# EAGLE design mp3 (EAGLE 9.1.1)
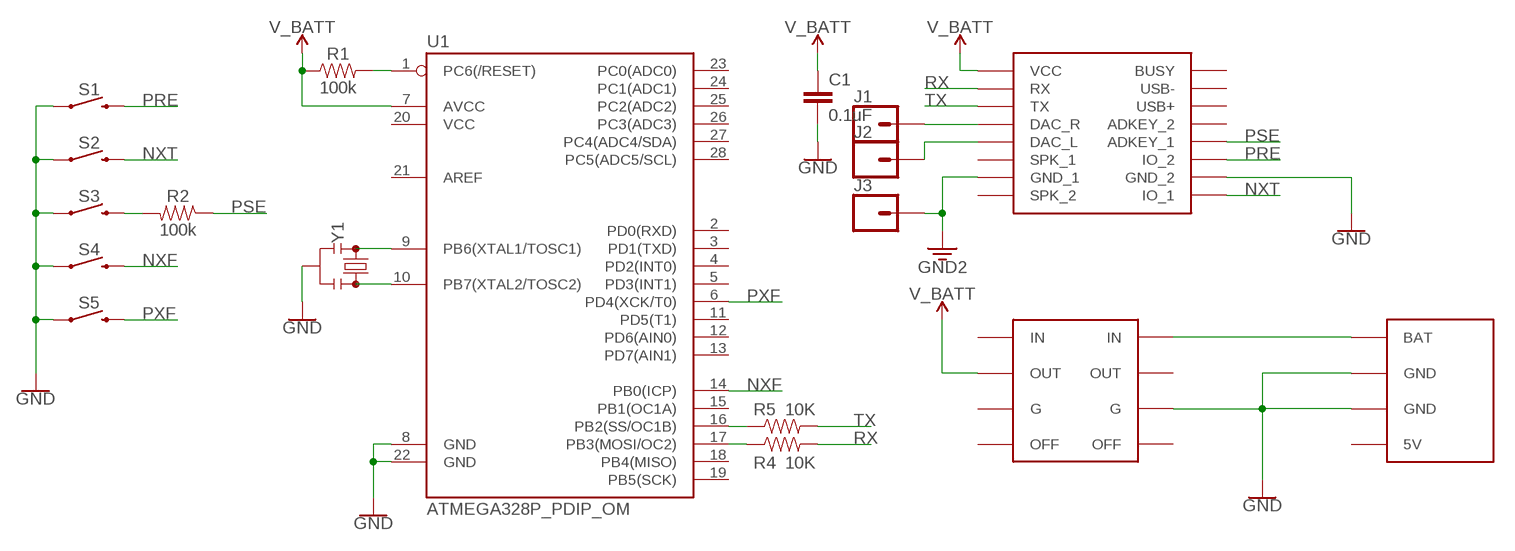
[diagram p0: schematic, sheet 1]

## Parts
C1  0.1uF  0.1UF-KIT-EZ-50V-20%  [CAP-PTH-SMALL-KIT]
J1  CONN_01PTH_NO_SILK_KIT  [1X01NS_KIT]
J2  CONN_01PTH_NO_SILK_KIT  [1X01NS_KIT]
J3  CONN_01PTH_NO_SILK_KIT  [1X01NS_KIT]
R1  100k  100KOHM-HORIZ-1/4W-1%  [AXIAL-0.3]
R2  100k  100KOHM-HORIZ-1/4W-1%  [AXIAL-0.3]
R4  10K  100KOHM-HORIZ-1/4W-1%  [AXIAL-0.3]
R5  10K  100KOHM-HORIZ-1/4W-1%  [AXIAL-0.3]
S1  MOMENTARY-SWITCH-SPST-PTH-RIGHT-ANGLE  [TACTILE_SWITCH_PTH_RIGHT_ANGLE]
S2  MOMENTARY-SWITCH-SPST-PTH-RIGHT-ANGLE  [TACTILE_SWITCH_PTH_RIGHT_ANGLE]
S3  MOMENTARY-SWITCH-SPST-PTH-RIGHT-ANGLE  [TACTILE_SWITCH_PTH_RIGHT_ANGLE]
S4  MOMENTARY-SWITCH-SPST-PTH-RIGHT-ANGLE  [TACTILE_SWITCH_PTH_RIGHT_ANGLE]
S5  MOMENTARY-SWITCH-SPST-PTH-RIGHT-ANGLE  [TACTILE_SWITCH_PTH_RIGHT_ANGLE]
U1  ATMEGA328P_PDIP_OM  [DIP28_OMILL]
U$1  DFPLAYER  [DFPLAYER]
U$2  ADAFRUIT_SOFTPOWER  [ADAFRUIT_SOFTPOWER]
U$3  ADAFRUIT_CHARGER  [ADAFRUIT_CHARGER]
Y1  RESONATOROM  [RESONATOR-PTH-7.6X3.3-OM]

## Nets
3.3V: J3.1 U$1.GND_1 ; supply symbol labelled GND2
GND: C1.2 S1.1 S2.1 S3.1 S4.1 S5.1 U1.8(GND) U1.22(GND) U$1.GND_2 U$2.P$2(G) U$3.P$2(GND) U$3.P$3(GND) Y1.2
N$1: U1.9(PB6(XTAL1/TOSC1)) Y1.1
N$2: U1.10(PB7(XTAL2/TOSC2)) Y1.3
N$3: R1.P$2 U1.1(PC6(/RESET))
N$4: R5.P$1 U1.17(PB3(MOSI/OC2))
N$5: R4.P$1 U1.16(PB2(SS/OC1B))
N$6: R2.P$2 S3.2
N$7: U$2.P$4(IN) U$3.P$1(BAT)
N$8: J1.1 U$1.DAC_R
N$9: J2.1 U$1.DAC_L
NXF: S4.2 U1.14(PB0(ICP))
NXT: S2.2 U$1.IO1(IO_1)
PRE: S1.2 U$1.IO2(IO_2)
PSE: R2.P$1 U$1.ADKEY1(ADKEY_1)
PXF: S5.2 U1.6(PD4(XCK/T0))
RX: R5.P$2 U$1.RX
TX: R4.P$2 U$1.TX
V_BATT: C1.1 R1.P$1 U1.7(AVCC) U$1.VCC U$2.P$6(OUT)
Unconnected: U1.2(PD0(RXD)) U1.3(PD1(TXD)) U1.4(PD2(INT0)) U1.5(PD3(INT1)) U1.11(PD5(T1)) U1.12(PD6(AIN0)) U1.13(PD7(AIN1)) U1.15(PB1(OC1A)) U1.18(PB4(MISO)) U1.19(PB5(SCK)) U1.20(VCC) U1.21(AREF) U1.23(PC0(ADC0)) U1.24(PC1(ADC1)) U1.25(PC2(ADC2)) U1.26(PC3(ADC3)) U1.27(PC4(ADC4/SDA)) U1.28(PC5(ADC5/SCL)) U$1.ADKEY2(ADKEY_2) U$1.BUSY U$1.SPK1(SPK_1) U$1.SPK2(SPK_2) U$1.USB+ U$1.USB- U$2.P$1(OFF) U$2.P$3(OUT) U$2.P$5(IN) U$2.P$7(G) U$2.P$8(OFF) U$3.P$4(5V)

## Library data of the parts
C1 = christy:0.1UF: 0.1µF ceramic capacitors A capacitor is a passive two-terminal electrical component used to store electrical energy temporarily in an electric field.; PROD_ID: CAP-08370
J1-J3 = SparkFun-Connectors:CONN_01: Single connection point. Often used as Generic Header-pin footprint for 0.1 inch spaced/style header connections On any of the 0.1 inch spaced packages, you can populate with these: Break Away Headers - Straight <https://www.sparkfun.com/products/116> (PRT-00116) Break Away Male Headers - Right Angle <https://www.sparkfun.com/products/553> (PRT-00553) Female Headers <https://www.sparkfun.com/products/115> (PRT-00115) Break Away Headers - Machine Pin <https://www.sparkfun.com/products/117> (PRT-00117) Break Away Female Headers - Swiss Machine Pin <https://www.sparkfun.com/products/743> (PRT-00743) This device is also useful as a general connection point to wire up your design to another part of your project. Our various solder wires solder well into these plated through hole pads. Hook-Up Wire - Assortment (Stranded, 22 AWG) <https://www.sparkfun.com/products/11375> (PRT-11375) Hook-Up Wire - Assortment (Solid Core, 22 AWG) <https://www.sparkfun.com/products/11367> (PRT-11367) View the entire wire category on our website here <https://www.sparkfun.com/categories/141> Special notes: SMTSO-256-ET is a "flush mount" nut for a 4-40 screw. We mostly use this on specialty testbeds; it is a nice way to connect hardware to your PCB at an adjustable hieght. Also note, the SNAP packages are for using a snappable style connector. We sell a baggie of snaps and they are also used on two LilyPad designs: Snap Assortment - 30 pack (male and female) <https://www.sparkfun.com/products/11347> (DEV-11347) LilyPad Arduino SimpleSnap <https://www.sparkfun.com/products/10941> (DEV-10941) LilyPad SimpleSnap Protoboard <https://www.sparkfun.com/products/10940> (DEV-10940)
R1 R2 = christy:100KOHM: 100kΩ resistor A resistor is a passive two-terminal electrical component that implements electrical resistance as a circuit element. Resistors act to reduce current flow, and, at the same time, act to lower voltage levels within circuits. - Wikipedia; PROD_ID: RES-12184
R4 R5 = christy:100KOHM: 100kΩ resistor A resistor is a passive two-terminal electrical component that implements electrical resistance as a circuit element. Resistors act to reduce current flow, and, at the same time, act to lower voltage levels within circuits. - Wikipedia; PROD_ID: RES-12184; VALUE: 100k
S1-S5 = SparkFun-Switches:MOMENTARY-SWITCH-SPST: Momentary Switch (Pushbutton) - SPST Normally-open (NO) SPST momentary switches (buttons, pushbuttons). Variants PTH-12MM - 12mm square, through-hole Momentary Pushbutton Switch - 12mm Square <https://www.sparkfun.com/products/9190> (COM-09190) PTH-6.0MM, PTH-6.0MM-KIT - 6.0mm square, through-hole Mini Pushbutton Switch <https://www.sparkfun.com/products/97> (COM-00097) KIT package intended for soldering kit's - only one side of pads' copper is exposed. PTH-RIGHT-ANGLE-KIT - Right-angle, through-hole Right Angle Tactile Button <https://www.sparkfun.com/products/10791> - Used on SparkFun BigTime Watch Kit <https://www.sparkfun.com/products/11734> SMD-12MM - 12mm square, surface-mount Tactile Button - SMD (12mm) <https://www.sparkfun.com/products/12993> (COM-12993) Used on SparkFun PicoBoard <https://www.sparkfun.com/products/11888> SMD-4.5MM - 4.5mm Square Trackball Switch Used on SparkFun Blackberry Trackballer Breakout <https://www.sparkfun.com/products/13169> SMD-4.6MMX2.8MM - 4.60mm x 2.80mm, surface mount Used on SparkFun SAMD21 Mini Breakout <https://www.sparkfun.com/products/13664> SMD-5.2MM, SMD-5.2-REDUNDANT - 5.2mm square, surface-mount Mini Pushbutton Switch - SMD <https://www.sparkfun.com/products/8720> (COM-08720) Used on Arduino Pro Mini <https://www.sparkfun.com/products/11114> REDUNDANT package connects both switch circuits together SMD-6.0X3.5MM - 6.0 x 3.5mm, surface mount Momentary Reset Switch SMD <https://www.sparkfun.com/products/8229> (COM-08229) SMD-6.2MM-TALL - 6.2mm square, surface mount Tactile Button - SMD (6mm) <https://www.sparkfun.com/products/12992> Used on SparkFun Digital Sandbox <https://www.sparkfun.com/products/12651> SMD-RIGHT-ANGLE - Right-angle, surface mount Used on SparkFun Block for Intel® Edison - Arduino <https://www.sparkfun.com/products/13036>; PROD_ID: CONN-10672; SF_SKU: COM-10791
U1 = christy:ATMEGA328P_PDIP: Atmel 328P Through hole ATMEGA328P uC used in the Arduino 32kb flash, 1k EEPROM, 2k SRAM Datasheet <http://www.sparkfun.com/datasheets/Components/SMD/ATMega328.pdf> SparkFun Products Storefront component: AVR 28 Pin 20MHz 32K 6A/D - ATMega328P <https://www.sparkfun.com/products/9061> (COM-09061) SparkFun Simon Says - Through-Hole Soldering Kit <https://www.sparkfun.com/products/10547> (KIT-10547) SparkFun Learn to Solder - Simon Says <https://www.sparkfun.com/products/13708> (KIT-13708) SparkFun BigTime Watch Kit <https://www.sparkfun.com/products/11734> (KIT-11734) SparkFun ClockIt <https://www.sparkfun.com/products/10930> (KIT-10930) SparkFun Serial Enabled LCD Kit <https://www.sparkfun.com/products/10097> (LCD-10097) SparkFun Simon Tilts - Through Hole Soldering Kit <https://www.sparkfun.com/products/12634> (KIT-12634) SparkFun Frequency Counter Kit <https://www.sparkfun.com/products/10140> (KIT-10140) FabFM Radio Kit <https://www.sparkfun.com/products/11043> (KIT-11043) SparkFun Binary Blaster Kit <https://www.sparkfun.com/products/12037> (KIT-12037) SparkFun Metro-Gnome <https://www.sparkfun.com/products/9236> (KIT-09236) ATmega328 with Arduino Optiboot (Uno) <https://www.sparkfun.com/products/10524> (DEV-10524)
U$1 = christy:DFPLAYER
U$2 = christy:ADAFRUIT_SOFTPOWER
U$3 = christy:ADAFRUIT_CHARGER
Y1 = christy:RESONATOR: Resonators (Generic) Ceramic resonators are clock-generating components, often used to control timing in microcontrollers. They usually have 3 pins: two pins for oscillation, and one pin for ground. Compared to crystals, resonators have worse tolerance, but are usually much cheaper. Plus, they have built-in load capacitors! These devices are used on boards like the Arduino Pro 8MHz <https://www.sparkfun.com/products/11114> and Arduino Pro 16MHz <https://www.sparkfun.com/products/11113>.

## Net classes
0 default: width 0.457 mm, drill 0.457 mm, clearance 0.457 mm

## Board
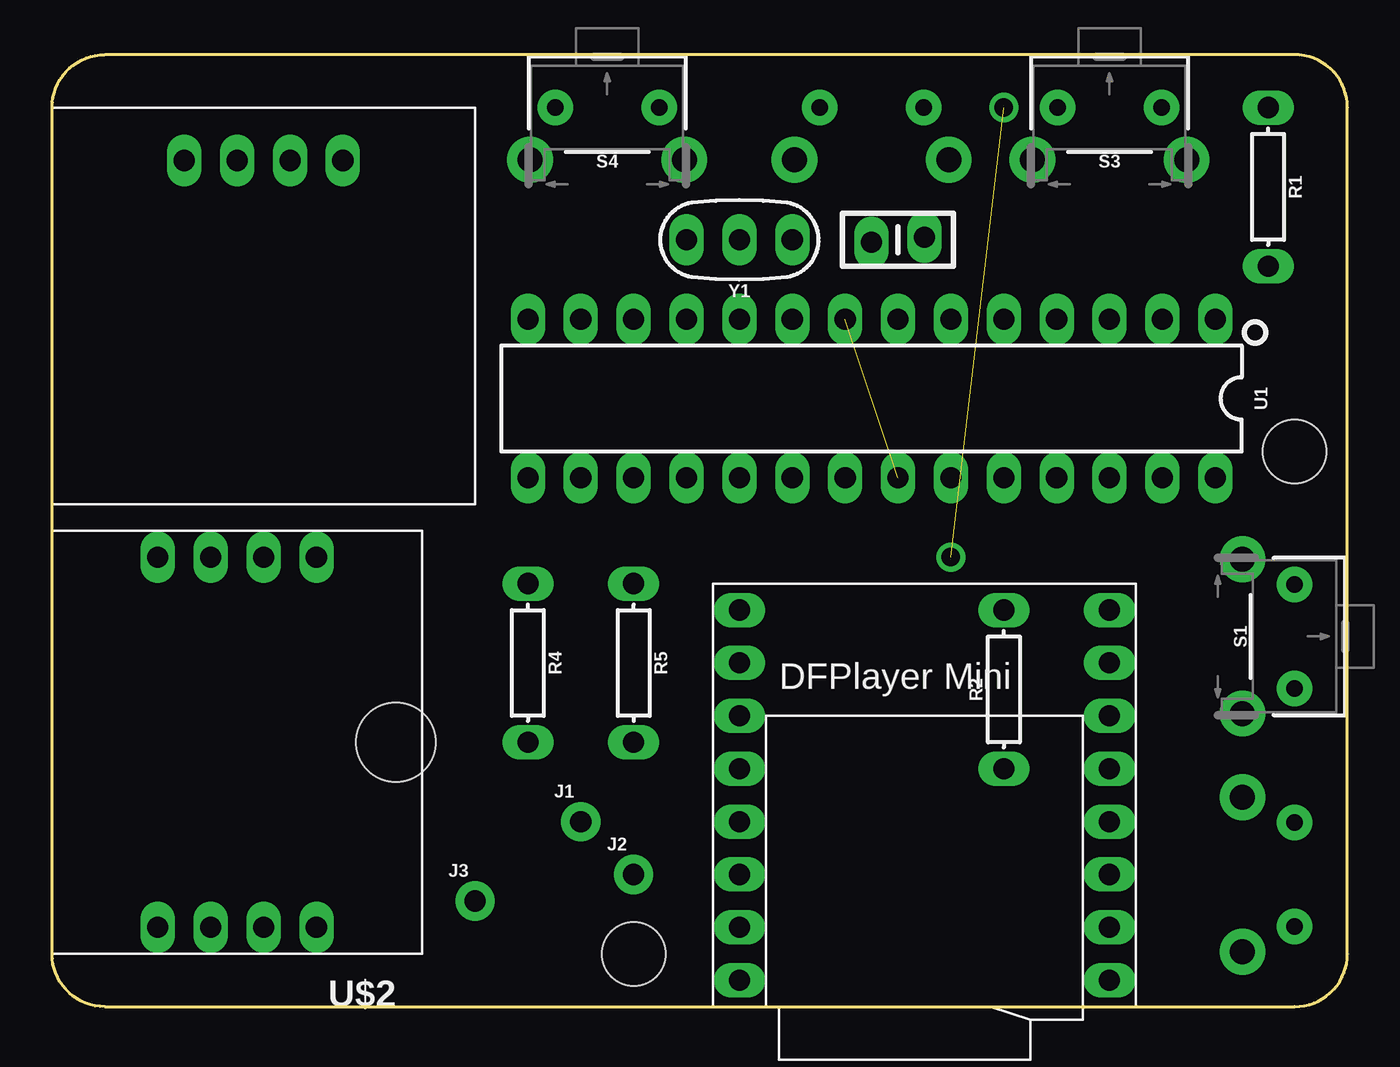
[diagram p1: board, top side]
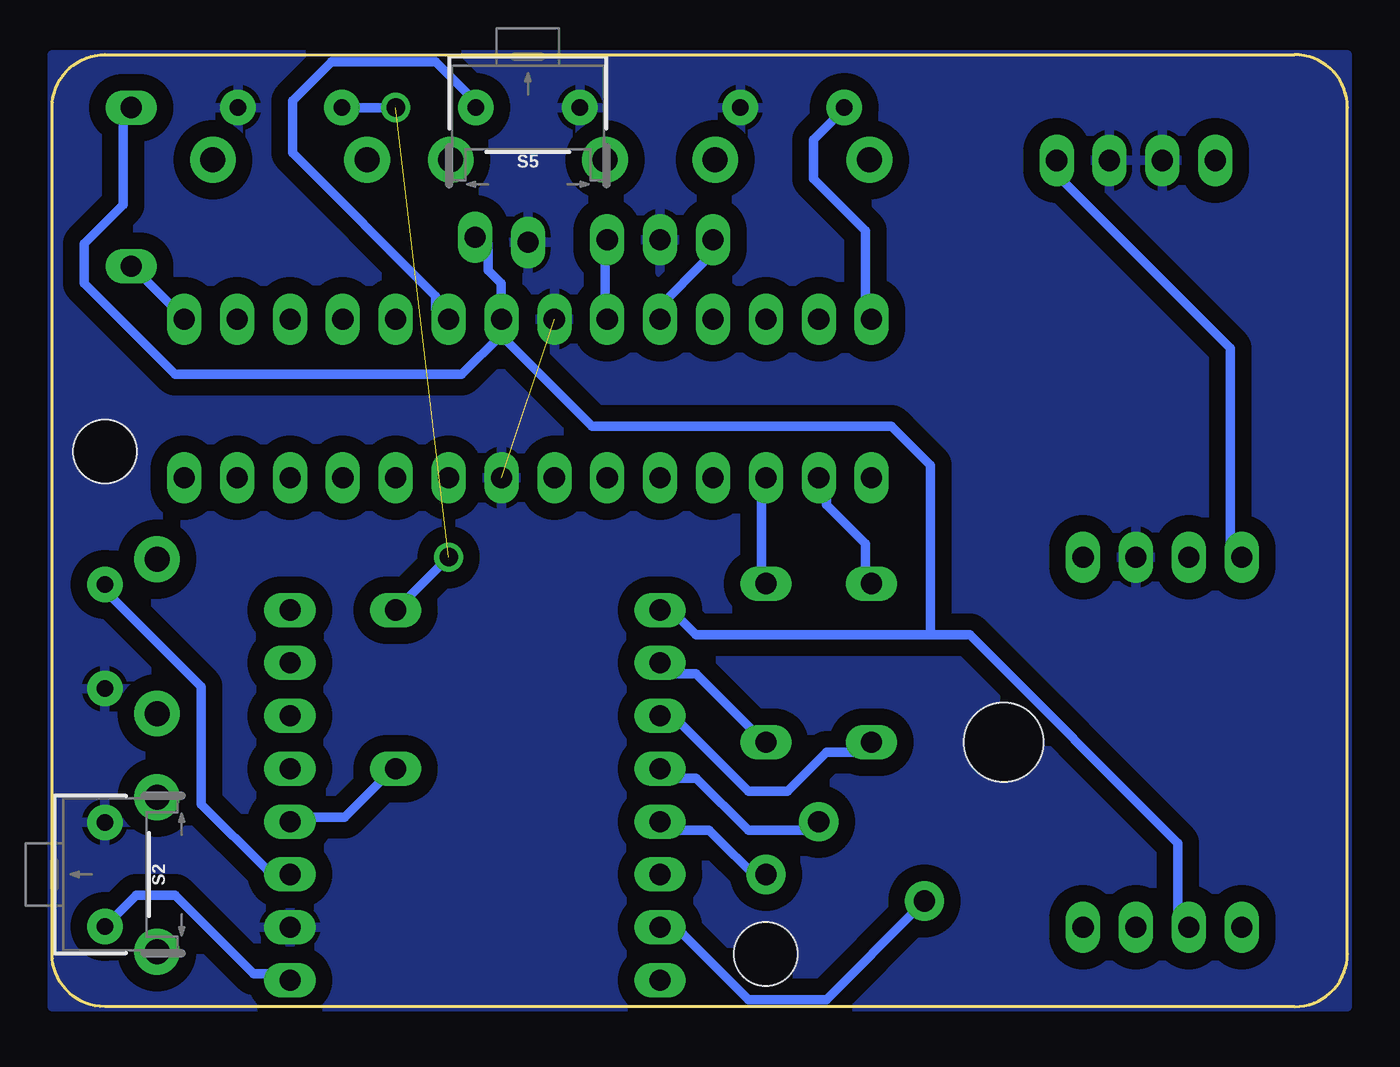
[diagram p2: board, bottom side, seen from below]

Size 62.23 x 45.72 mm. Coordinates in mm from the lower left corner, seen from the top.
Outline: 2.54,0 59.69,0 arc90 62.23,2.54 62.23,43.18 arc90 59.69,45.72 2.54,45.72 arc90 0,43.18 0,2.54 arc90 2.54,0
Copper layers (1*16): Top 0.035mm / dielectric 1.5mm / Bottom 0.035mm
Design rules "OthermillDRC_1_32_v2": minimum track width 8mil, minimum drill 0.8mm, track to track 0.794003125mm, track to pad 0.794003125mm, pad to pad 0.794003125mm, via to via 0.794003125mm, smd to smd 0mil, copper to edge 0mil, drill to drill 1mil, minimum pad ring 10mil, minimum via ring 10mil, stop-mask expansion 1mil, vias tented up to drill 30mil, thermal gap 10mil
Holes 3.05 mm at 59.69,26.67 27.94,2.54
Holes 3.81 mm at 16.51,12.7

### Footprints (pad centres in the part's own frame; a part is rotated, then mirrored left to right if it is on the bottom)
CAP-PTH-SMALL-KIT = drill 1.016 pad 1.651 long: 1 -1.27,-0.127; 2 1.27,0.127
1X01NS_KIT = drill 1.016 pad 1.88: 1 0,0
AXIAL-0.3 = drill 1.016 pad 1.651 long: P$1 -3.81,0; P$2 3.81,0
TACTILE_SWITCH_PTH_RIGHT_ANGLE = drill 0.8 pad 1.7: 1 -2.5,0; 2 2.5,0 | drill 1.2 pad 2.2: ANCHOR1 -3.703,2.5; ANCHOR2 3.703,2.5
DIP28_OMILL = drill 1.016 pad 1.651 long: 1 -16.51,-3.81; 2 -13.97,-3.81; 3 -11.43,-3.81; 4 -8.89,-3.81; 5 -6.35,-3.81; 6 -3.81,-3.81; 7 -1.27,-3.81; 8 1.27,-3.81; 9 3.81,-3.81; 10 6.35,-3.81; 11 8.89,-3.81; 12 11.43,-3.81; 13 13.97,-3.81; 14 16.51,-3.81; 15 16.51,3.81; 16 13.97,3.81; 17 11.43,3.81; 18 8.89,3.81; 19 6.35,3.81; 20 3.81,3.81; 21 1.27,3.81; 22 -1.27,3.81; 23 -3.81,3.81; 24 -6.35,3.81; 25 -8.89,3.81; 26 -11.43,3.81; 27 -13.97,3.81; 28 -16.51,3.81
DFPLAYER = drill 1.016 pad 1.651 long: ADKEY1 8.89,-1.27; ADKEY2 8.89,1.27; BUSY 8.89,8.89; DAC_L -8.89,-1.27; DAC_R -8.89,1.27; GND_1 -8.89,-6.35; GND_2 8.89,-6.35; IO1 8.89,-8.89; IO2 8.89,-3.81; RX -8.89,6.35; SPK1 -8.89,-3.81; SPK2 -8.89,-8.89; TX -8.89,3.81; USB+ 8.89,3.81; USB- 8.89,6.35; VCC -8.89,8.89
ADAFRUIT_SOFTPOWER = drill 1.016 pad 1.651 long: P$1 -3.81,-8.89; P$2 -1.27,-8.89; P$3 1.27,-8.89; P$4 3.81,-8.89; P$5 3.81,8.89; P$6 1.27,8.89; P$7 -1.27,8.89; P$8 -3.81,8.89
ADAFRUIT_CHARGER = drill 1.016 pad 1.651 long: P$1 -3.81,0; P$2 -1.27,0; P$3 1.27,0; P$4 3.81,0
RESONATOR-PTH-7.6X3.3-OM = drill 1.016 pad 1.651 long: 1 -2.54,0; 2 0,0; 3 2.54,0

### Placement (x,y rotation side)
C1  40.64,36.83 180 top
J1  25.4,8.89 0 top
J2  27.94,6.35 0 top
J3  20.32,5.08 0 top
R1  58.42,39.37 270 top
R2  45.72,15.24 90 top
R4  22.86,16.51 270 top
R5  27.94,16.51 270 top
S1  59.69,17.78 90 top
S2  59.69,6.35 270 bottom
S3  50.8,43.18 180 top
S4  26.67,43.18 180 top
S5  39.37,43.18 180 bottom
U1  39.37,29.21 180 top
U$1  41.91,10.16 0 top
U$2  8.89,12.7 180 top
U$3  10.16,40.64 180 top
Y1  33.02,36.83 180 top

### Tracks (layer width: path | path; a pad name or v marks a point on that pad's centre or on a via)
3.3V
  Bottom 0.457: U$1.GND_1 32.54,3.47 31.91,3.47 28.78,0.34 25.03,0.34 20.65,4.72 J3.1
GND  (1 unrouted)
  pour Bottom: 0,2.54 0,45.72 62.23,45.72 62.23,0 0,0
N$1
  Bottom 0.457: U1.9 35.66,33.5 35.66,36.63 Y1.1
N$2
  Bottom 0.457: Y1.3 30.66,36.63 30.66,36 33.16,33.5 U1.10
N$3
  Bottom 0.457: U1.1 56.31,33.5 58.19,35.38 R1.P$2
N$4
  Bottom 0.457: R5.P$1 28.16,20.36 28.16,25.37 U1.17
N$5
  Bottom 0.457: R4.P$1 23.15,20.36 23.15,22.24 25.03,24.12 25.03,25.37 U1.16
N$6  (via drill 0.89 pad 1.27)  (1 unrouted)
  Bottom 0.457: S3.2 v45.72,43.18 | R2.P$2 v43.18,21.59
N$7
  Bottom 0.457: U$2.P$4 5.64,21.61 5.64,31.62 14.39,40.38 U$3.P$1
N$8
  Bottom 0.457: U$1.DAC_R 32.54,10.98 31.28,10.98 28.78,8.48 25.66,8.48 J1.1
N$9
  Bottom 0.457: U$1.DAC_L 32.54,8.48 30.66,8.48 28.16,5.97 J2.1
NXF
  Bottom 0.457: U1.14 23.15,33.5 23.15,37.25 25.66,39.76 25.66,41.63 24.4,42.88 S4.2
NXT
  Bottom 0.457: U$1.IO1 51.3,1.59 52.56,1.59 56.31,5.35 58.19,5.35 59.44,4.1 S2.2
PRE
  Bottom 0.457: U$1.IO2 51.3,6.6 51.93,6.6 55.06,9.73 55.06,15.36 59.44,19.74 S1.2
PSE
  Bottom 0.457: U$1.ADKEY1 50.68,9.1 48.18,9.1 46.3,10.98 R2.P$1
PXF
  Bottom 0.457: U1.6 43.8,33.5 43.8,34.13 50.68,41.01 50.68,43.51 48.8,45.39 43.8,45.39 41.92,43.51 S5.2
RX
  Bottom 0.457: R5.P$2 28.16,12.86 31.28,15.98 32.54,15.98 U$1.RX
TX
  Bottom 0.457: R4.P$2 23.15,12.23 25.03,12.23 26.91,10.35 28.78,10.35 32.54,14.11 U$1.TX
V_BATT
  Bottom 0.457: U1.7 40.67,33.5 40.67,34.75 41.3,35.38 41.3,36.63 C1.1 | 40.67,32.25 40.04,32.88 U1.7 | 40.67,32.25 42.55,30.37 56.31,30.37 60.69,34.75 60.69,36.63 58.81,38.5 58.81,42.88 R1.P$1 | 20.02,17.86 31.28,17.86 32.54,19.11 U$1.VCC | 20.02,17.86 18.15,17.86 8.14,7.85 8.14,4.1 U$2.P$6 | 40.67,32.25 36.29,27.87 21.9,27.87 20.02,25.99 20.02,17.86 | 40.67,32.25 U1.7